# Altium schematic sheet BLDC-sensorless-prototip-1.SchDoc
size A3; SheetNumber: 1; SheetTotal: 1
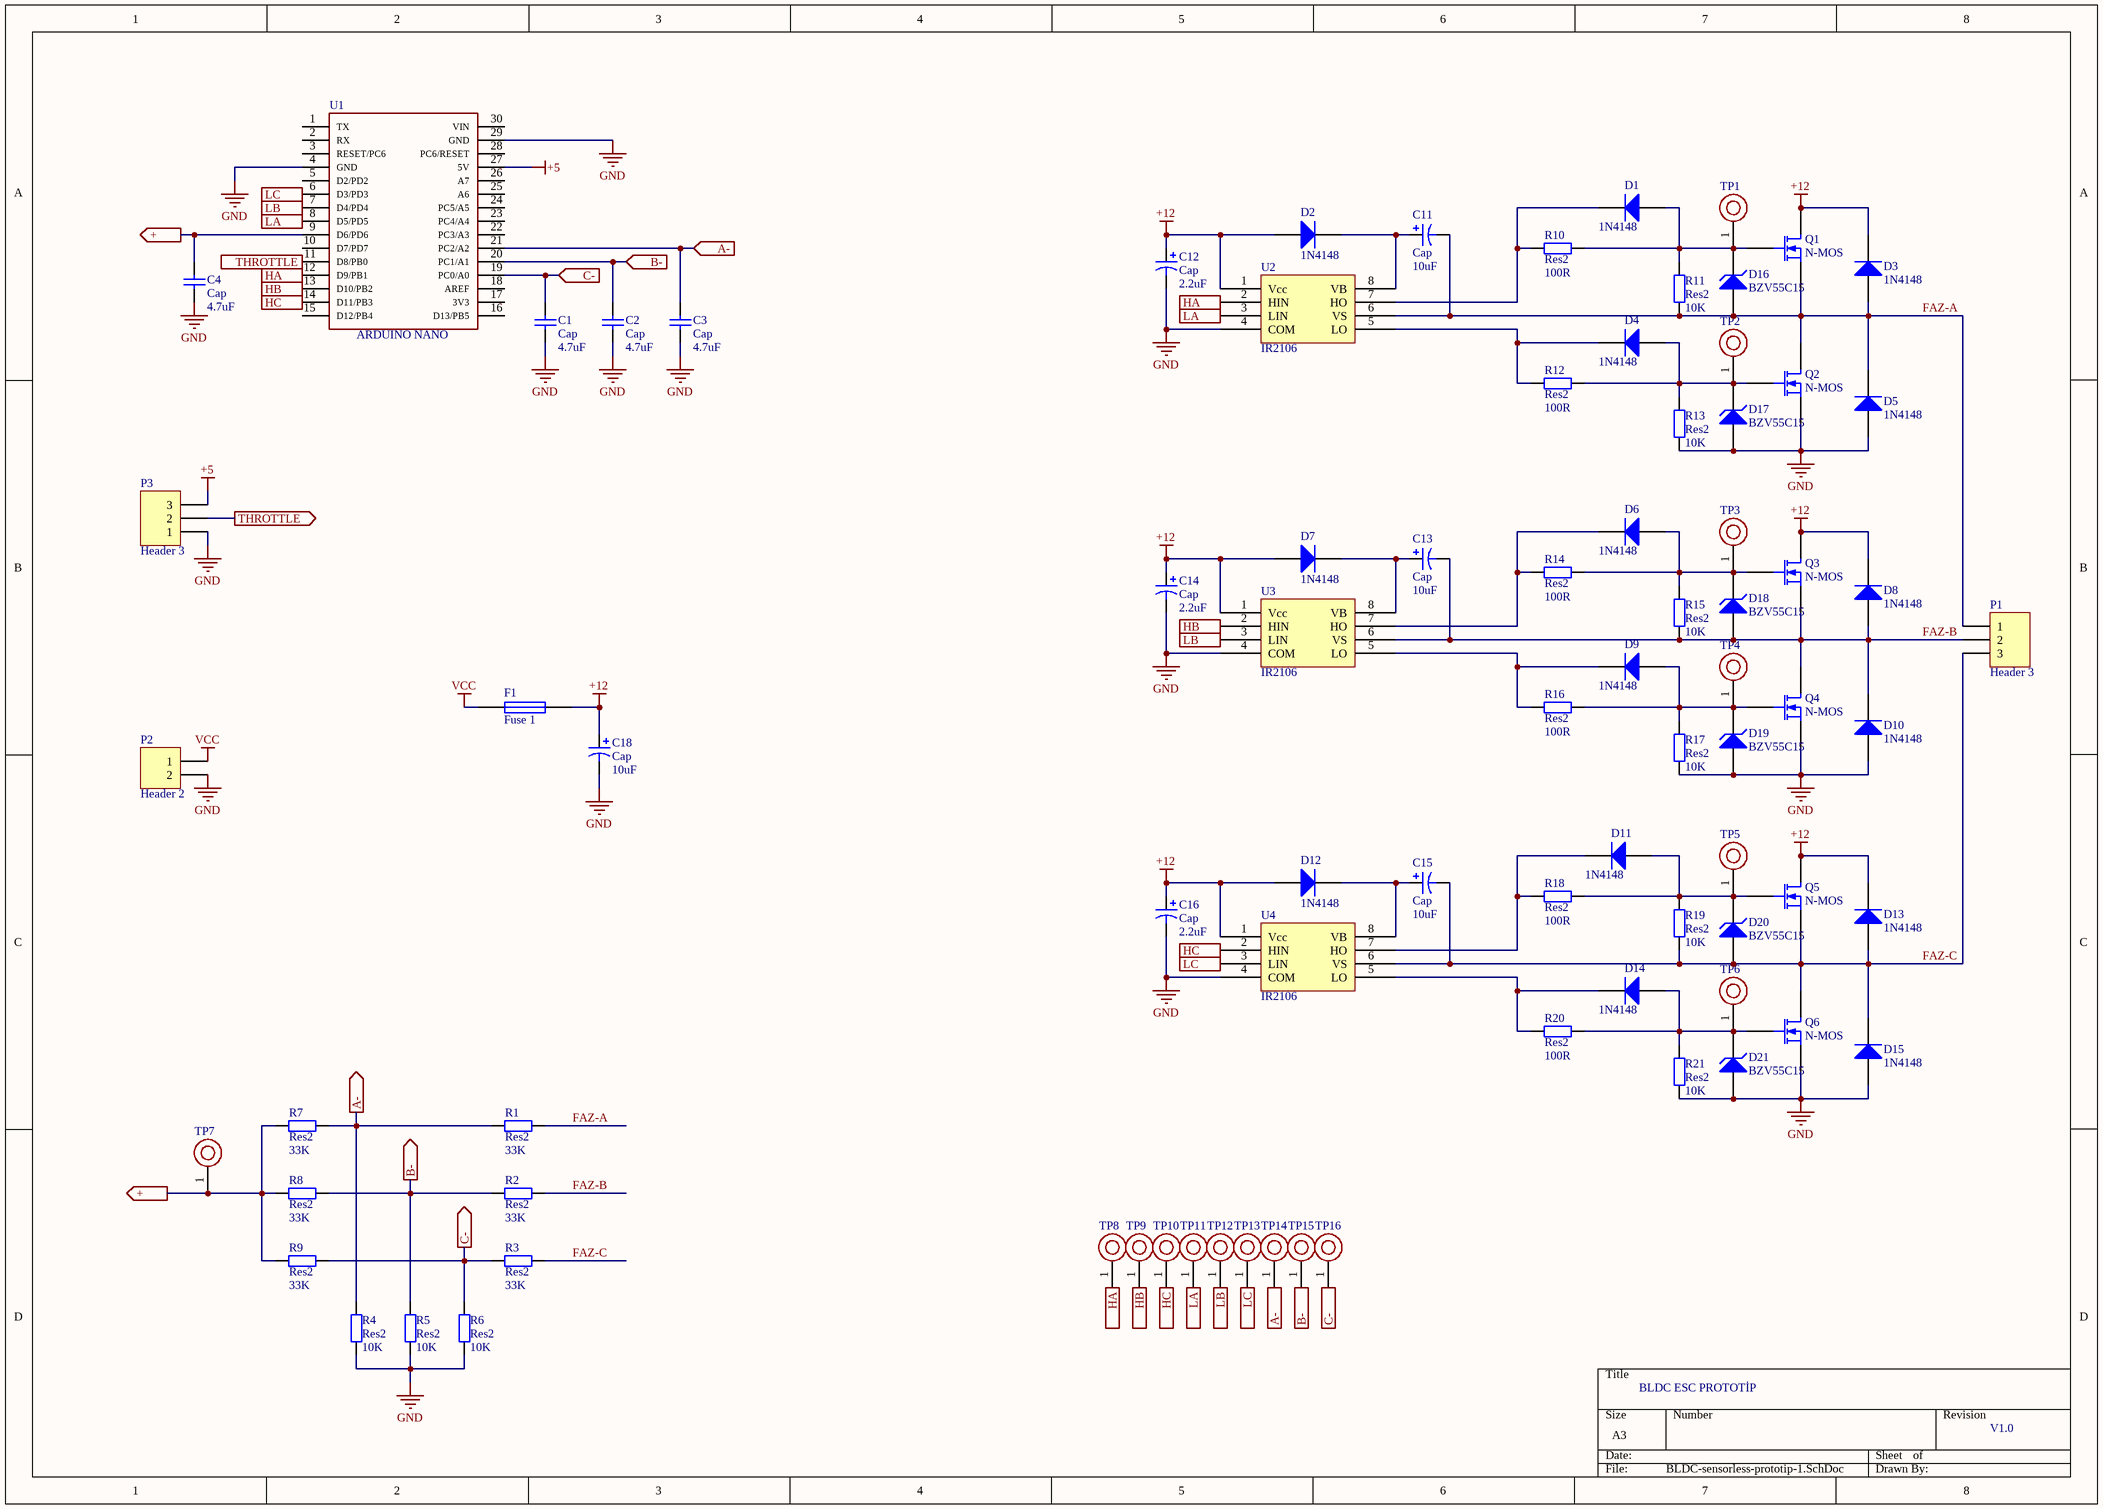
[diagram p0: BLDC-sensorless-prototip-1.SchDoc]

## Parts
C1  Cap  value 4.7uF  [CAP-1206]
C2  Cap  value 4.7uF  [CAP-1206]
C3  Cap  value 4.7uF  [CAP-1206]
C4  Cap  value 4.7uF  [CAP-1206]
C11  Cap  value 10uF  [CAP-ELEC-2.54MM]
C12  Cap  value 2.2uF  [CAP-ELEC-2.54MM]
C13  Cap  value 10uF  [CAP-ELEC-2.54MM]
C14  Cap  value 2.2uF  [CAP-ELEC-2.54MM]
C15  Cap  value 10uF  [CAP-ELEC-2.54MM]
C16  Cap  value 2.2uF  [CAP-ELEC-2.54MM]
C18  Cap  value 10uF  [CAP-ELEC-2.54MM]
D1  1N4148  [DO-213-minielf (SOD80)]
D2  1N4148  [DO-213-minielf (SOD80)]
D3  1N4148  [DO-213-minielf (SOD80)]
D4  1N4148  [DO-213-minielf (SOD80)]
D5  1N4148  [DO-213-minielf (SOD80)]
D6  1N4148  [DO-213-minielf (SOD80)]
D7  1N4148  [DO-213-minielf (SOD80)]
D8  1N4148  [DO-213-minielf (SOD80)]
D9  1N4148  [DO-213-minielf (SOD80)]
D10  1N4148  [DO-213-minielf (SOD80)]
D11  1N4148  [DO-213-minielf (SOD80)]
D12  1N4148  [DO-213-minielf (SOD80)]
D13  1N4148  [DO-213-minielf (SOD80)]
D14  1N4148  [DO-213-minielf (SOD80)]
D15  1N4148  [DO-213-minielf (SOD80)]
D16  BZV55C15  [DO-213-minielf (SOD80)]
D17  BZV55C15  [DO-213-minielf (SOD80)]
D18  BZV55C15  [DO-213-minielf (SOD80)]
D19  BZV55C15  [DO-213-minielf (SOD80)]
D20  BZV55C15  [DO-213-minielf (SOD80)]
D21  BZV55C15  [DO-213-minielf (SOD80)]
F1  Fuse 1  [FUSE HOLDER]
P1  Header 3  [3.81MM KLEMENS X3]
P2  Header 2  [5.08MM KLEMENS X2]
P3  Header 3  [2.54MM ERKEK HEADER X3]
Q1  N-MOS  [TO-252-3]
Q2  N-MOS  [TO-252-3]
Q3  N-MOS  [TO-252-3]
Q4  N-MOS  [TO-252-3]
Q5  N-MOS  [TO-252-3]
Q6  N-MOS  [TO-252-3]
R1  Res2  value 33K  [RES-1206]
R2  Res2  value 33K  [RES-1206]
R3  Res2  value 33K  [RES-1206]
R4  Res2  value 10K  [RES-1206]
R5  Res2  value 10K  [RES-1206]
R6  Res2  value 10K  [RES-1206]
R7  Res2  value 33K  [RES-1206]
R8  Res2  value 33K  [RES-1206]
R9  Res2  value 33K  [RES-1206]
R10  Res2  value 100R  [RES-1206]
R11  Res2  value 10K  [RES-1206]
R12  Res2  value 100R  [RES-1206]
R13  Res2  value 10K  [RES-1206]
R14  Res2  value 100R  [RES-1206]
R15  Res2  value 10K  [RES-1206]
R16  Res2  value 100R  [RES-1206]
R17  Res2  value 10K  [RES-1206]
R18  Res2  value 100R  [RES-1206]
R19  Res2  value 10K  [RES-1206]
R20  Res2  value 100R  [RES-1206]
R21  Res2  value 10K  [RES-1206]
TP1  TEST POINT  [Test Point]  (value not drawn)
TP2  TEST POINT  [Test Point]  (value not drawn)
TP3  TEST POINT  [Test Point]  (value not drawn)
TP4  TEST POINT  [Test Point]  (value not drawn)
TP5  TEST POINT  [Test Point]  (value not drawn)
TP6  TEST POINT  [Test Point]  (value not drawn)
TP7  TEST POINT  [Test Point]  (value not drawn)
TP8  TEST POINT  [Test Point]  (value not drawn)
TP9  TEST POINT  [Test Point]  (value not drawn)
TP10  TEST POINT  [Test Point]  (value not drawn)
TP11  TEST POINT  [Test Point]  (value not drawn)
TP12  TEST POINT  [Test Point]  (value not drawn)
TP13  TEST POINT  [Test Point]  (value not drawn)
TP14  TEST POINT  [Test Point]  (value not drawn)
TP15  TEST POINT  [Test Point]  (value not drawn)
TP16  TEST POINT  [Test Point]  (value not drawn)
U1  ARDUINO NANO  [ARDUINO NANO]
U2  IR2106  [DIP-8]
U3  IR2106  [DIP-8]
U4  IR2106  [DIP-8]

## Ports
+ (out), A- (in), A- (out), B- (in), B- (out), C- (in), C- (out), HA (in), HA (out), HB (in), HB (out), HC (in), HC (out), LA (in), LA (out), LB (in), LB (out), LC (in), LC (out), THROTTLE (in), THROTTLE (out)

## Nets
+5: P3.3 U1.27(5V)
+12: C12.1 C14.1 C16.1 C18.1 D2.1(A) D3.2(K) D7.1(A) D8.2(K) D12.1(A) D13.2(K) F1.2 Q1.2(D) Q3.2(D) Q5.2(D) U2.1(Vcc) U3.1(Vcc) U4.1(Vcc)
GND: C1.1 C2.1 C3.1 C4.1 C12.2 C14.2 C16.2 C18.2 D5.1(A) D10.1(A) D15.1(A) D17.1(A) D19.1(A) D21.1(A) P2.2 P3.1 Q2.3(S) Q4.3(S) Q6.3(S) R4.1 R5.1 R6.1 R13.1 R17.1 R21.1 U1.4(GND) U1.29(GND) U2.4(COM) U3.4(COM) U4.4(COM)
VCC: F1.1 P2.1
+: C4.2 R7.1 R8.1 R9.1 TP7.1 U1.9(D6/PD6) ; port +
A-: C3.2 R1.1 R4.2 R7.2 TP14.1 U1.21(PC2/A2) ; port A-
B-: C2.2 R2.1 R5.2 R8.2 TP15.1 U1.20(PC1/A1) ; port B-
C-: C1.2 R3.1 R6.2 R9.2 TP16.1 U1.19(PC0/A0) ; port C-
FAZ-A: C11.2 D3.1(A) D5.2(K) D16.1(A) P1.1 Q1.3(S) Q2.2(D) R1.2 R11.1 U2.6(VS)
FAZ-B: C13.2 D8.1(A) D10.2(K) D18.1(A) P1.2 Q3.3(S) Q4.2(D) R2.2 R15.1 U3.6(VS)
FAZ-C: C15.2 D13.1(A) D15.2(K) D20.1(A) P1.3 Q5.3(S) Q6.2(D) R3.2 R19.1 U4.6(VS)
HA: TP8.1 U1.12(D9/PB1) U2.2(HIN) ; port HA
HB: TP9.1 U1.13(D10/PB2) U3.2(HIN) ; port HB
HC: TP10.1 U1.14(D11/PB3) U4.2(HIN) ; port HC
LA: TP11.1 U1.8(D5/PD5) U2.3(LIN) ; port LA
LB: TP12.1 U1.7(D4/PD4) U3.3(LIN) ; port LB
LC: TP13.1 U1.6(D3/PD3) U4.3(LIN) ; port LC
THROTTLE: P3.2 U1.11(D8/PB0) ; port THROTTLE
NetC11_1: C11.1 D2.2(K) U2.8(VB)
NetC13_1: C13.1 D7.2(K) U3.8(VB)
NetC15_1: C15.1 D12.2(K) U4.8(VB)
NetD1_1: D1.1(A) D16.2(K) Q1.1(G) R10.2 R11.2 TP1.1
NetD1_2: D1.2(K) R10.1 U2.7(HO)
NetD4_1: D4.1(A) D17.2(K) Q2.1(G) R12.2 R13.2 TP2.1
NetD4_2: D4.2(K) R12.1 U2.5(LO)
NetD6_1: D6.1(A) D18.2(K) Q3.1(G) R14.2 R15.2 TP3.1
NetD6_2: D6.2(K) R14.1 U3.7(HO)
NetD9_1: D9.1(A) D19.2(K) Q4.1(G) R16.2 R17.2 TP4.1
NetD9_2: D9.2(K) R16.1 U3.5(LO)
NetD11_1: D11.1(A) D20.2(K) Q5.1(G) R18.2 R19.2 TP5.1
NetD11_2: D11.2(K) R18.1 U4.7(HO)
NetD14_1: D14.1(A) D21.2(K) Q6.1(G) R20.2 R21.2 TP6.1
NetD14_2: D14.2(K) R20.1 U4.5(LO)

Not connected (* = marked no-connect by the designer): U1 1(TX) 2(RX) 3(RESET/PC6) 5(D2/PD2) 10(D7/PD7) 15(D12/PB4) 16(D13/PB5) 17(3V3) 18(AREF) 22(PC3/A3) 23(PC4/A4) 24(PC5/A5) 25(A6) 26(A7) 28(PC6/RESET) 30(VIN)

## Notes on the sheet
- BLDC ESC PROTOTİP
- V1.0

## Library data of the parts
C1-C4 = Cap: Capacitor; Published: 8-Jun-2000; LatestRevisionDate: 17-Jul-2002; LatestRevisionNote: Re-released for DXP Platform.; PackageReference: RAD-0.3; Publisher: Altium Limited; PackageDescription: Radial Cap, Thru-Hole; 2 Leads; 0.3 in Pin Spacing
C11-C16 C18 = Cap Pol1: Polarized Capacitor (Radial); Published: 8-Jun-2000; LatestRevisionDate: 17-Jul-2002; LatestRevisionNote: Re-released for DXP Platform.; PackageReference: RB7.6-15; Publisher: Altium Limited; PackageDescription: Polarized Capacitor (Radial); 2 Leads
D1 D2 D4 D6 D7 D9 D11 D12 D14 = Diode 1N4148: High Conductance Fast Diode; Published: 8-Jun-2000; LatestRevisionDate: 17-Jul-2002; LatestRevisionNote: Re-released for DXP Platform.; DatasheetVersion: 1997; PackageReference: DO-35; Publisher: Altium Limited; PackageDescription: Diode, Axial; Body 3.8 x 1.9 mm (LxDia. max), Lead Dia. 0.53 mm (max); Code_JEDEC: DO-204-AH; ComponentLink1Description: Manufacturer Link; ComponentLink1URL: http://www.fairchildsemi.com/; ComponentLink2Description: Datasheet; ComponentLink2URL: http://www.fairchildsemi.com/ds/1N%2F1N4148.pdf
D3 D5 D8 D10 D13 D15 = Diode: Default Diode; Published: 8-Jun-2000; LatestRevisionDate: 17-Jul-2002; LatestRevisionNote: Re-released for DXP Platform.; PackageVersion: Sep-1996; PackageReference: SMC; Publisher: Altium Limited; PackageDescription: DO-214-AB/SMC; 2 C-Bend Leads; Body 7.9 x 5.9 mm, inc. leads (LxW); Code_JEDEC: DO-214-AB
D16-D21 = D Zener: Zener Diode; Published: 8-Jun-2000; LatestRevisionDate: 17-Jul-2002; LatestRevisionNote: Re-released for DXP Platform.; PackageReference: DIODE-0.7; Publisher: Altium Limited; PackageDescription: Diode, Thru-Hole; 2 Leads; 0.7 in Pin Spacing
F1 = Fuse 1: Fuse; Published: 8-Jun-2000; LatestRevisionDate: 17-Jul-2002; LatestRevisionNote: Re-released for DXP Platform.; PackageReference: PIN-W2/E2.8; Publisher: Altium Limited; PackageDescription: Thru-Hole; 2 Leads
P1 P3 = Header 3: Header, 3-Pin; LatestRevisionDate: 17-Jul-2002; LatestRevisionNote: Re-released for DXP Platform.; Publisher: Altium Limited
P2 = Header 2: Header, 2-Pin; LatestRevisionDate: 17-Jul-2002; LatestRevisionNote: Re-released for DXP Platform.; Publisher: Altium Limited
Q1-Q6 = MOSFET-N: N-Channel MOSFET; Published: 8-Jun-2000; LatestRevisionDate: 17-Jul-2002; LatestRevisionNote: Re-released for DXP Platform.; PackageVersion: 1995/1996; PackageReference: E3; Publisher: Altium Limited; PackageDescription: TO, Flat Index; 3 In-Line, Axial Leads; Body Dia. 4.6mm; Lead Dia. 0.5 mm (max)
R1-R21 = Res2: Resistor; Published: 8-Jun-2000; LatestRevisionDate: 17-Jul-2002; LatestRevisionNote: Re-released for DXP Platform.; PackageReference: AXIAL-0.4; Publisher: Altium Limited; PackageDescription: Axial Device, Thru-Hole; 2 Leads; 0.4 in Pin Spacing